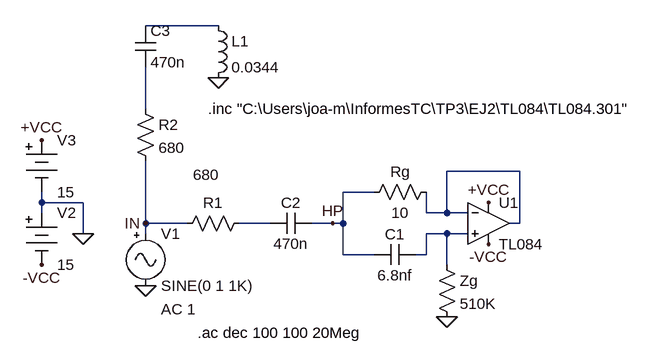
[diagram p0: schematic gyrator_Highpass.asc]
gyrator_Highpass.asc, the LTspice schematic file:
Version 4
SHEET 1 880 680
WIRE -272 -144 -384 -144
WIRE -384 -16 -384 -80
WIRE 192 80 80 80
WIRE -32 112 -80 112
WIRE -544 128 -544 112
WIRE -480 128 -544 128
WIRE -544 144 -544 128
WIRE 48 144 48 112
WIRE 80 144 80 80
WIRE 80 144 48 144
WIRE 112 144 80 144
WIRE -384 160 -384 64
WIRE -320 160 -384 160
WIRE -192 160 -240 160
WIRE -96 160 -128 160
WIRE -80 160 -80 112
WIRE -80 160 -96 160
WIRE 192 160 192 80
WIRE 192 160 176 160
WIRE -480 176 -480 128
WIRE -384 176 -384 160
WIRE 80 176 48 176
WIRE 112 176 80 176
WIRE -80 208 -80 160
WIRE -32 208 -80 208
WIRE 48 208 48 176
WIRE 48 208 32 208
WIRE 80 224 80 176
FLAG 80 304 0
FLAG -384 256 0
FLAG -544 32 +VCC
FLAG -544 224 -VCC
FLAG -480 176 0
FLAG -96 160 HP
FLAG -384 160 IN
FLAG 144 128 +VCC
FLAG 144 192 -VCC
FLAG -272 -64 0
SYMBOL res 64 96 R90
WINDOW 0 0 56 VBottom 2
WINDOW 3 32 56 VTop 2
SYMATTR InstName Rg
SYMATTR Value 10
SYMBOL res 64 208 R0
SYMATTR InstName Zg
SYMATTR Value 510K
SYMBOL cap 32 192 R90
WINDOW 0 0 32 VBottom 2
WINDOW 3 32 32 VTop 2
SYMATTR InstName C1
SYMATTR Value 6.8nf
SYMBOL res -224 144 R90
WINDOW 0 0 56 VBottom 2
WINDOW 3 -74 67 VTop 2
SYMATTR InstName R1
SYMATTR Value 680
SYMBOL cap -128 144 R90
WINDOW 0 0 32 VBottom 2
WINDOW 3 32 32 VTop 2
SYMATTR InstName C2
SYMATTR Value 470n
SYMBOL Misc\\signal -384 160 R0
WINDOW 123 24 132 Left 2
WINDOW 39 0 0 Left 0
SYMATTR Value2 AC 1
SYMATTR InstName V1
SYMBOL Misc\\battery -544 128 R0
WINDOW 123 0 0 Left 0
WINDOW 39 0 0 Left 0
SYMATTR InstName V2
SYMATTR Value 15
SYMBOL Misc\\battery -544 16 R0
WINDOW 123 0 0 Left 0
WINDOW 39 0 0 Left 0
SYMATTR InstName V3
SYMATTR Value 15
SYMBOL Opamps\\opamp2 144 96 R0
SYMATTR InstName U1
SYMATTR Value TL084
SYMATTR SpiceModel TL084
SYMBOL res -400 -32 R0
SYMATTR InstName R2
SYMATTR Value 680
SYMBOL cap -400 -144 R0
SYMATTR InstName C3
SYMATTR Value 470n
SYMBOL ind -288 -160 R0
SYMATTR InstName L1
SYMATTR Value 0.0344
TEXT -304 328 Left 2 !.ac dec 100 100 20Meg
TEXT -288 -16 Left 2 !.inc "C:\\Users\\joa-m\\InformesTC\\TP3\\EJ2\\TL084\\TL084.301"

The netlist it stands for:
* gyrator_Highpass.asc
Rg N003 HP 10
R§Zg N005 0 510K
C1 N005 HP 6.8nf
R1 N004 IN 680
C2 HP N004 470n
V1 IN 0 SINE(0 1 1K) AC 1
V2 0 -VCC 15
V3 +VCC 0 15
XU1 N005 N003 +VCC -VCC N003 TL084 TL084  ; pins In+ In- V+ V- OUT
R2 N002 IN 680
C3 N001 N002 470n
L1 N001 0 0.0344
.ac dec 100 100 20Meg
.inc "C:\Users\joa-m\InformesTC\TP3\EJ2\TL084\TL084.301"
.backanno
.end